# EAGLE design Rev A (Main Board) (EAGLE 9.6.2)
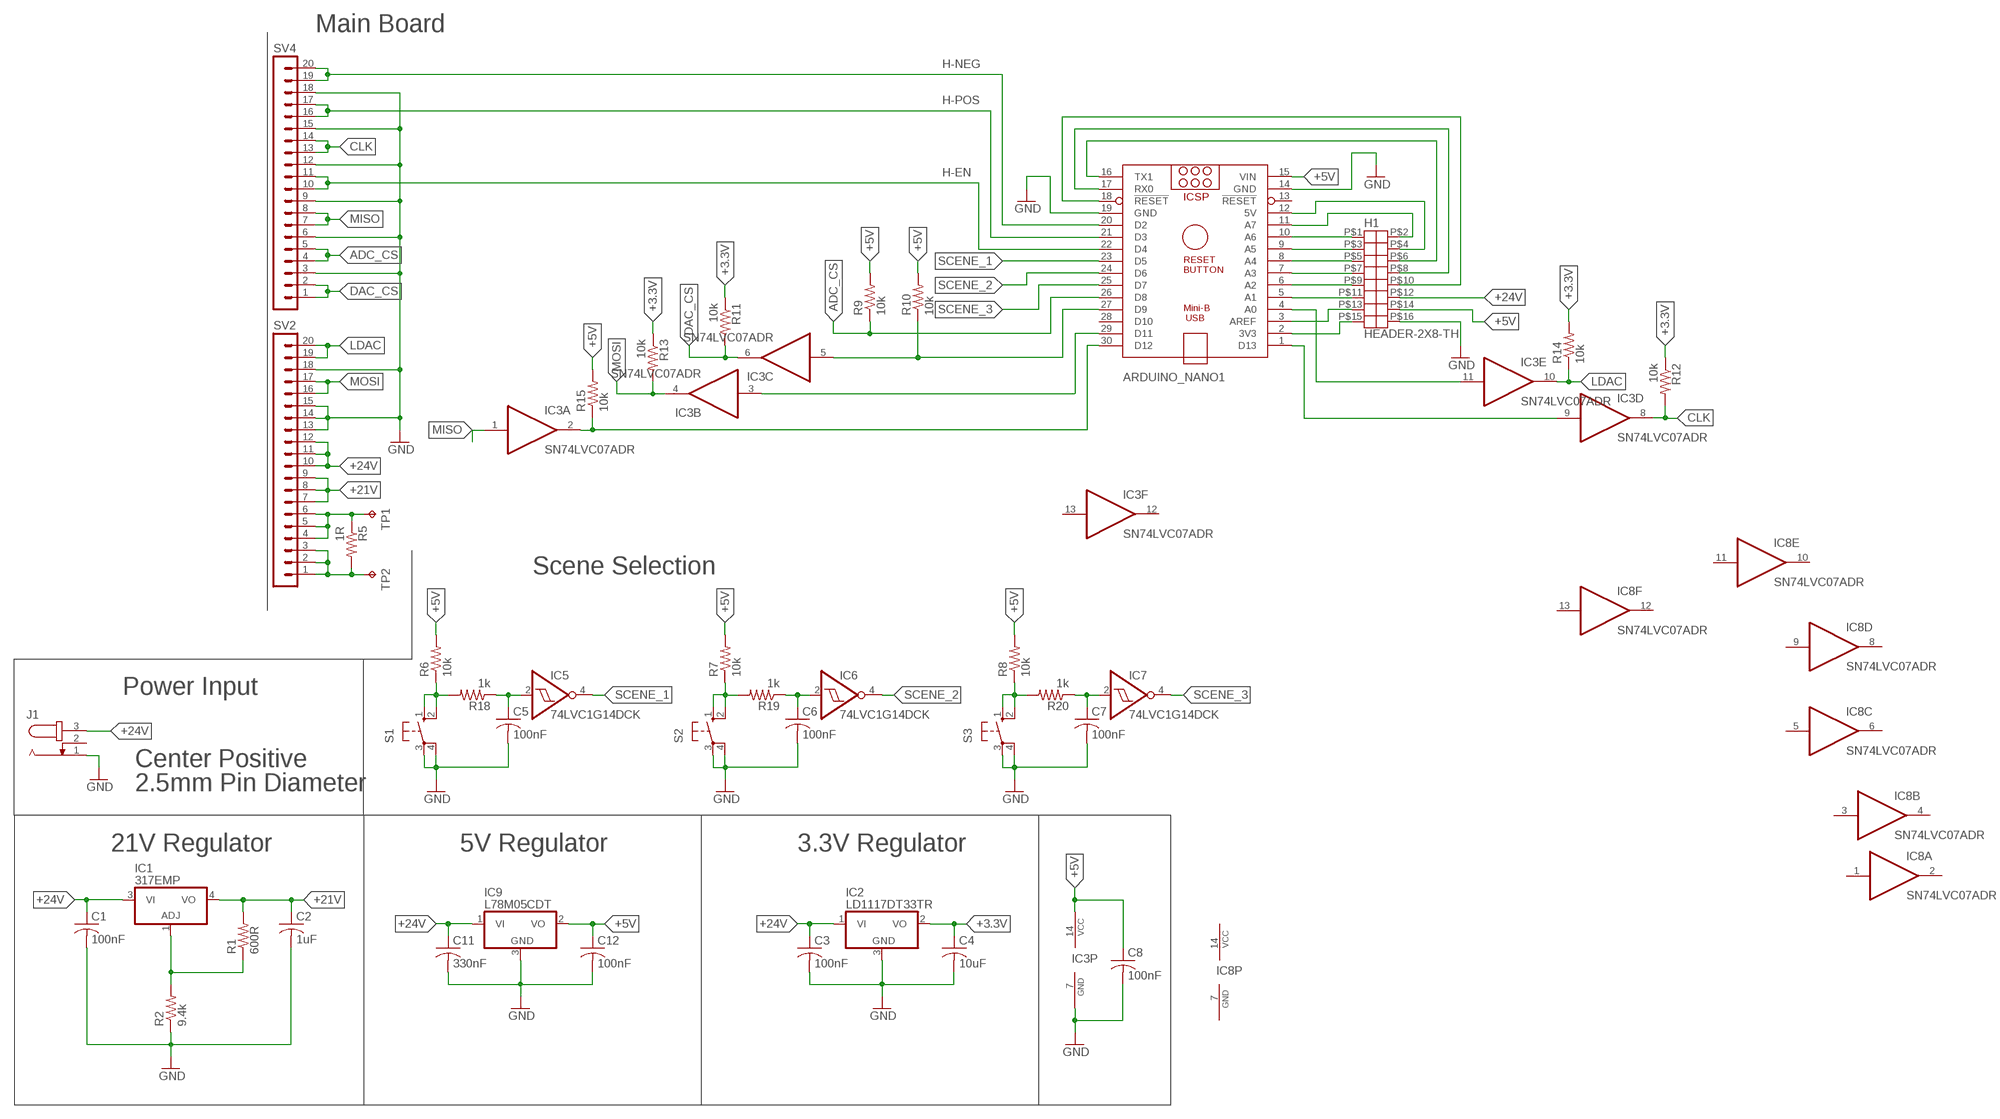
[diagram p0: schematic, sheet 1]

## Parts
ARDUINO_NANO1  ARDUINO_NANO  [ARDUINO_NANO]
C1  100nF  C-USC0603  [C0603]
C2  1uF  C-USC1206  [C1206]
C3  100nF  C-USC0603  [C0603]
C4  10uF  C-USC0603  [C0603]
C5  100nF  C-USC0603  [C0603]
C6  100nF  C-USC0603  [C0603]
C7  100nF  C-USC0603  [C0603]
C8  100nF  C-USC0603  [C0603]
C11  330nF  C-USC0603  [C0603]
C12  100nF  C-USC0603  [C0603]
H1  HEADER-2X8-TH  [HEADER-2X8-TH]
IC1  317EMP  [SOT223]
IC2  LD1117DT33TR  7818DT  [TO252]
IC3  SN74LVC07ADR  74LS07D  [SO14]
IC5  74LVC1G14DCK  [SC70-5]
IC6  74LVC1G14DCK  [SC70-5]
IC7  74LVC1G14DCK  [SC70-5]
IC8  SN74LVC07ADR  74LS07D  [SO14]
IC9  L78M05CDT  7818DT  [TO252]
J1  JACK-PLUG1  [SPC4078]
R1  600R  R-US_R0603  [R0603]
R2  9.4k  R-US_R0603  [R0603]
R5  1R  R-US_R1206  [R1206]
R6  10k  R-US_R0603  [R0603]
R7  10k  R-US_R0603  [R0603]
R8  10k  R-US_R0603  [R0603]
R9  10k  R-US_R0603  [R0603]
R10  10k  R-US_R0603  [R0603]
R11  10k  R-US_R0603  [R0603]
R12  10k  R-US_R0603  [R0603]
R13  10k  R-US_R0603  [R0603]
R14  10k  R-US_R0603  [R0603]
R15  10k  R-US_R0603  [R0603]
R18  1k  R-US_R0603  [R0603]
R19  1k  R-US_R0603  [R0603]
R20  1k  R-US_R0603  [R0603]
S1  10-XX  [B3F-10XX]
S2  10-XX  [B3F-10XX]
S3  10-XX  [B3F-10XX]
SV2  MA20-1W  [MA20-1W]
SV4  MA20-1W  [MA20-1W]
TP1  TPB2,54  [B2,54]
TP2  TPB2,54  [B2,54]

## Nets
+3.3V: C4.1 IC2.2(VO) R11.1 R12.1 R13.1 R14.2
+5V: ARDUINO_NANO1.15(VIN) C8.1 C12.1 H1.P$14 IC3.14(P:VCC) IC9.2(VO) R6.2 R7.2 R8.2 R9.2 R10.2 R15.2
+21V: C2.1 IC1.4(VO) R1.2 SV2.7 SV2.8 SV2.9
+24V: C1.1 C3.1 C11.1 H1.P$12 IC1.3(VI) IC2.1(VI) IC9.1(VI) J1.3 SV2.10 SV2.11 SV2.12
ADC_CS: ARDUINO_NANO1.26(D8) R9.1 SV4.4 SV4.5
CLK: IC3.8(D:O) R12.2 SV4.13 SV4.14
DAC_CS: IC3.6(C:O) R11.2 SV4.1 SV4.2
GND: ARDUINO_NANO1.14(GND) ARDUINO_NANO1.19(GND) C1.2 C2.2 C3.2 C4.2 C5.2 C6.2 C7.2 C8.2 C11.2 C12.2 H1.P$16 IC2.3(GND) IC3.7(P:GND) IC9.3(GND) J1.1 R2.1 S1.3(P) S1.4(P1) S2.3(P) S2.4(P1) S3.3(P) S3.4(P1) SV2.13 SV2.14 SV2.15 SV2.18 SV4.3 SV4.6 SV4.9 SV4.12 SV4.15 SV4.18
LDAC: IC3.10(E:O) R14.1 SV2.19 SV2.20
MISO: IC3.1(A:I) SV4.7 SV4.8
MOSI: IC3.4(B:O) R13.2 SV2.16 SV2.17
N$2: IC1.1(ADJ) R1.1 R2.2
N$3: ARDUINO_NANO1.20(D2) SV4.19 SV4.20
N$4: ARDUINO_NANO1.2(3V3) H1.P$15
N$5: ARDUINO_NANO1.21(D3) SV4.16 SV4.17
N$6: ARDUINO_NANO1.3(AREF) H1.P$13
N$7: ARDUINO_NANO1.5(A1) H1.P$11
N$8: ARDUINO_NANO1.6(A2) H1.P$9
N$9: ARDUINO_NANO1.22(D4) SV4.10 SV4.11
N$10: ARDUINO_NANO1.7(A3) H1.P$7
N$11: ARDUINO_NANO1.8(A4) H1.P$5
N$12: ARDUINO_NANO1.9(A5) H1.P$3
N$13: ARDUINO_NANO1.10(A6) H1.P$1
N$14: ARDUINO_NANO1.11(A7) H1.P$2
N$15: ARDUINO_NANO1.12(5V) H1.P$4
N$16: ARDUINO_NANO1.16(TX1) H1.P$6
N$17: ARDUINO_NANO1.17(RX0) H1.P$8
N$18: ARDUINO_NANO1.18(!RESET) H1.P$10
N$19: ARDUINO_NANO1.27(D9) IC3.5(C:I) R10.1
N$20: ARDUINO_NANO1.1(D13) IC3.9(D:I)
N$21: ARDUINO_NANO1.29(D11) IC3.3(B:I)
N$22: R5.1 SV2.4 SV2.5 SV2.6 TP1.TP
N$23: R5.2 SV2.1 SV2.2 SV2.3 TP2.TP
N$24: ARDUINO_NANO1.4(A0) IC3.11(E:I)
N$25: ARDUINO_NANO1.30(D12) IC3.2(A:O) R15.1
N$27: R6.1 R18.2 S1.1(S) S1.2(S1)
N$28: C5.1 IC5.2(I) R18.1
N$29: R7.1 R19.2 S2.1(S) S2.2(S1)
N$30: C6.1 IC6.2(I) R19.1
N$31: R8.1 R20.2 S3.1(S) S3.2(S1)
N$32: C7.1 IC7.2(I) R20.1
SCENE_1: ARDUINO_NANO1.23(D5) IC5.4(O)
SCENE_2: ARDUINO_NANO1.24(D6) IC6.4(O)
SCENE_3: ARDUINO_NANO1.25(D7) IC7.4(O)
Unconnected: ARDUINO_NANO1.13(!RESET) ARDUINO_NANO1.28(D10) IC3.12(F:O) IC3.13(F:I) IC8.1(A:I) IC8.2(A:O) IC8.3(B:I) IC8.4(B:O) IC8.5(C:I) IC8.6(C:O) IC8.8(D:O) IC8.9(D:I) IC8.10(E:O) IC8.11(E:I) IC8.12(F:O) IC8.13(F:I) J1.2

## Notes on the sheet
- Main Board
- H-NEG
- H-POS
- H-EN
- Scene Selection
- Power Input
- Center Positive
- 2.5mm Pin Diameter
- 21V Regulator | 5V Regulator | 3.3V Regulator

## Power pins joined to a net without a drawn wire
GND: IC5.3(GND) IC6.3(GND) IC7.3(GND) IC8.7(P:GND)
VCC: IC5.5(VCC) IC6.5(VCC) IC7.5(VCC) IC8.14(P:VCC)

## Library data of the parts
ARDUINO_NANO1 = ArduinoNanoV30:ARDUINO_NANO: Arduino Nano V3.0 Overview: The Arduino Nano is a small, complete, and breadboard-friendly board based on the ATmega328 (Arduino Nano 3.x) or ATmega168 (Arduino Nano 2.x). It has more or less the same functionality of the Arduino Duemilanove, but in a different package. It lacks only a DC power jack, and works with a Mini-B USB cable instead of a standard one. The Nano was designed and is being produced by Gravitech. Specifications: Microcontroller Atmel ATmega168 or ATmega328 Operating Voltage (logic level) 5 V Input Voltage (recommended) 7-12 V Input Voltage (limits) 6-20 V Digital I/O Pins 14 (of which 6 provide PWM output) Analog Input Pins 8 DC Current per I/O Pin 40 mA Flash Memory 16 KB (ATmega168) or 32 KB (ATmega328) of which 2 KB used by bootloader SRAM 1 KB (ATmega168) or 2 KB (ATmega328) EEPROM 512 bytes (ATmega168) or 1 KB (ATmega328) Clock Speed 16 MHz Dimensions 0.73" x 1.70" Length 45 mm Width 18 mm Weigth 5 g Power: The Arduino Nano can be powered via the Mini-B USB connection, 6-20V unregulated external power supply (pin 30), or 5V regulated external power supply (pin 27). The power source is automatically selected to the highest voltage source. Memory: The ATmega168 has 16 KB of flash memory for storing code (of which 2 KB is used for the bootloader); the ATmega328 has 32 KB, (also with 2 KB used for the bootloader). The ATmega168 has 1 KB of SRAM and 512 bytes of EEPROM (which can be read and written with the EEPROM library); the ATmega328 has 2 KB of SRAM and 1 KB of EEPROM. Input and Output: Each of the 14 digital pins on the Nano can be used as an input or output, using pinMode(), digitalWrite(), and digitalRead() functions. They operate at 5 volts. Each pin can provide or receive a maximum of 40 mA and has an internal pull-up resistor (disconnected by default) of 20-50 kOhms. In addition, some pins have specialized functions. Visit Arduino - ArduinoBoardNano <https://www.arduino.cc/en/Main/ArduinoBoardNano>
C1-C8 C11 C12 = MMIModular Parts:C-US: CAPACITOR, American symbol; SPICEPREFIX: C
H1 = 4ms-main-parts:HEADER-2X8: SMT HEADER 2x8 Unshrouded: Cixi Langling LL1010-5C (HI TEMP 2*8PIN) Shrouded: Cixi Langling LL1007-3 (2*8PIN)
IC1 = linear:*317: Positive VOLTAGE REGULATOR
IC2 IC9 = linear:78*: Positive VOLTAGE REGULATOR Source: http://cache.national.com/ds/LM/LM78L05.pdf http://www.fairchildsemi.com/ds/LM/LM7805.pdf
IC3 IC8 = 74xx-us:74*07: Hex BUFFER, open collector high-voltage output
IC5-IC7 = 74xx-little-de:74*1G14: Single Schmitt-Trigger Inverter Gate
J1 = con-jack:JACK-PLUG: DC POWER JACK Power Jack, DC, Right Angle, Through Hole, Rated 5A at 16VDC, PC Terminals Distributor: Farnell (www.Farnell.de) Drawing: 84N1161.pdf / 84N1162.pdf Manufacturer: SPC Technology (www.spctechnology.com) Type: SPC4077 / SPC 4078; OC_FARNELL: unknown; OC_NEWARK: unknown
R1 R2 R5-R15 R18-R20 = MMIModular Parts:R-US_: RESISTOR, American symbol; SPICEPREFIX: R
S1-S3 = switch-omron:10-XX: OMRON SWITCH; MPN: B3F-1000; OC_FARNELL: 176432; OC_NEWARK: 36M3542
SV2 SV4 = con-lstb:MA20-1W: PIN HEADER; OC_FARNELL: unknown; OC_NEWARK: unknown
TP1 TP2 = testpad:TP: Test pad

## Board
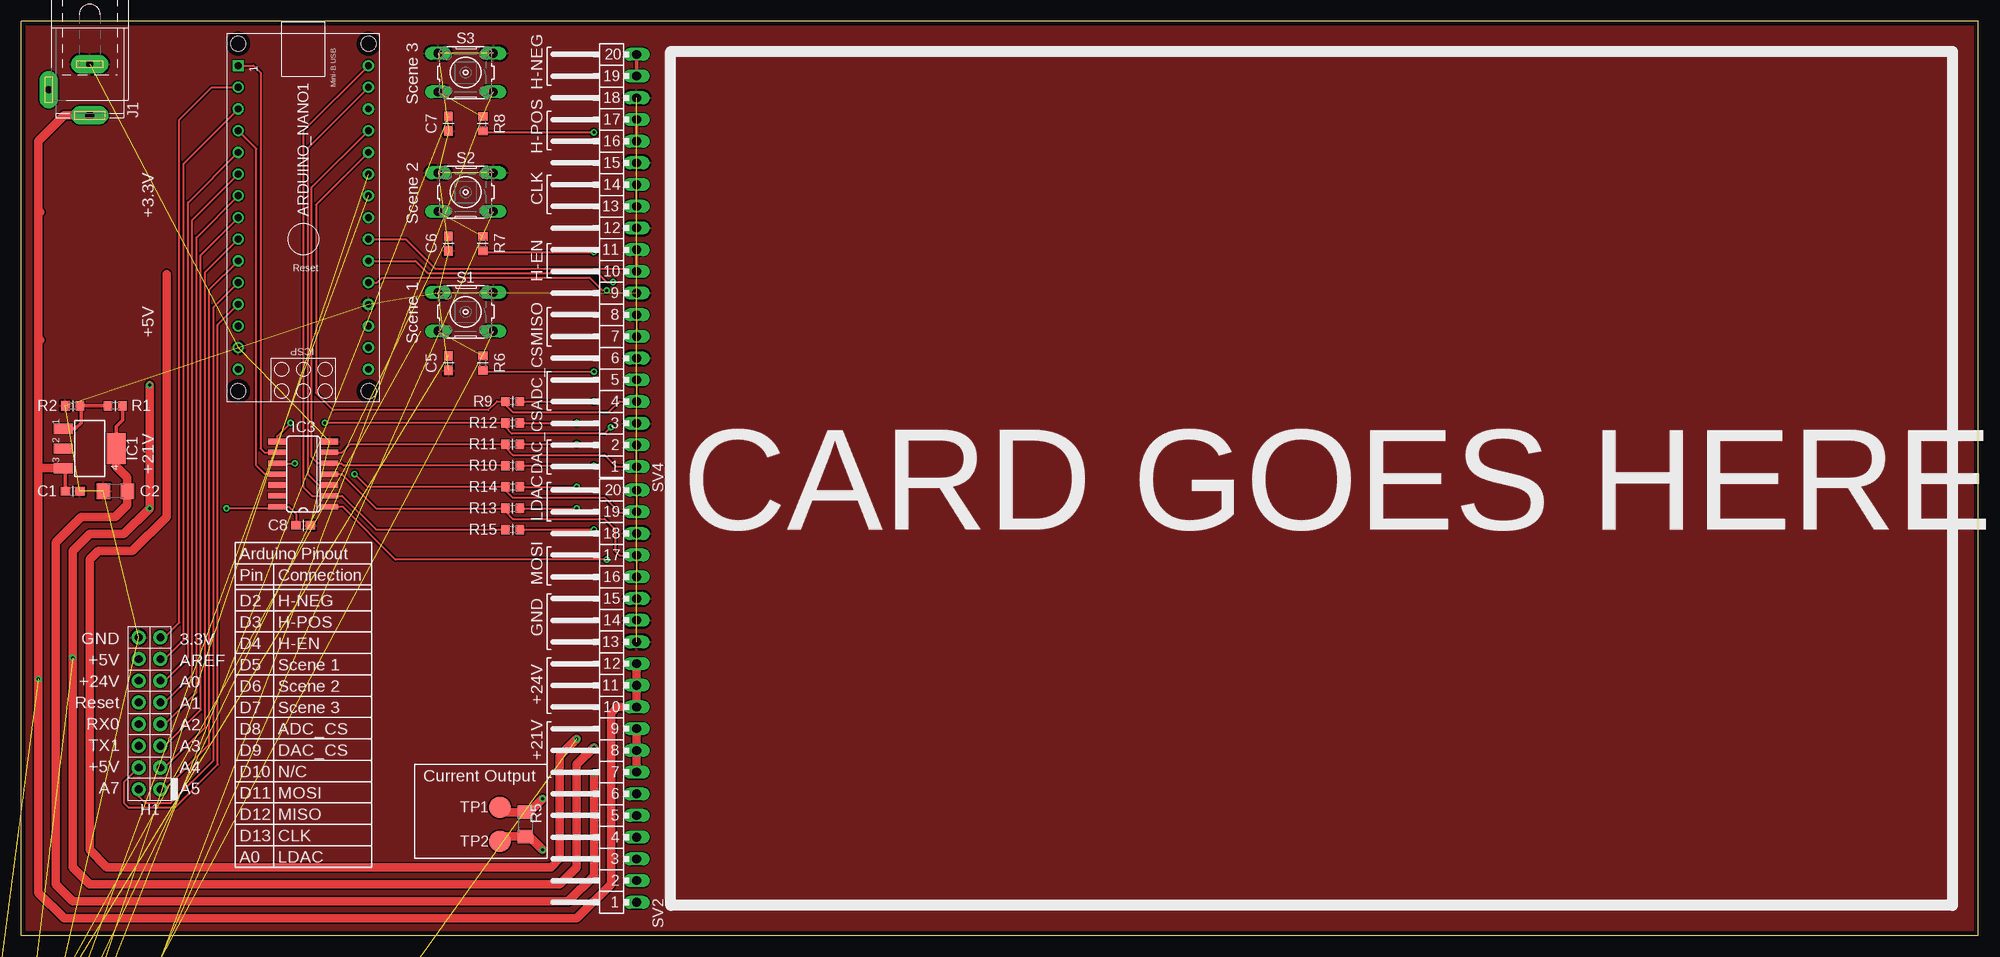
[diagram p1: board, top side]
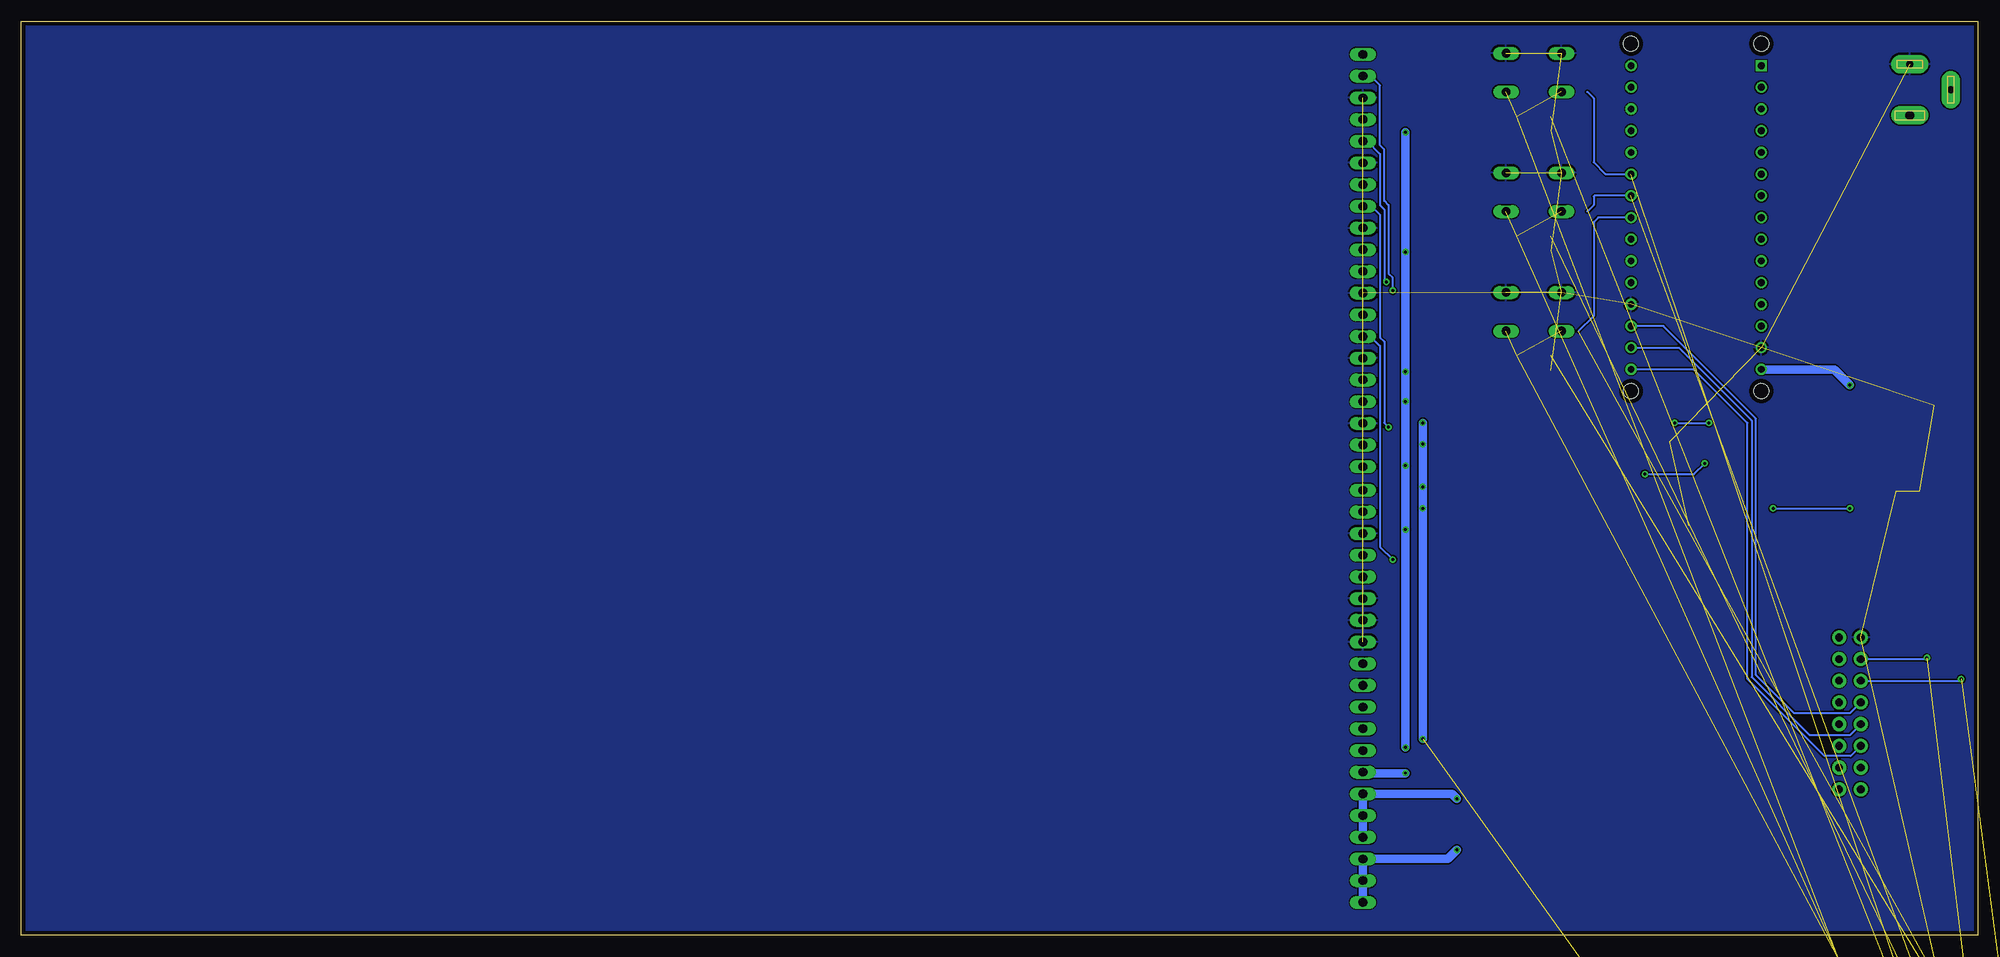
[diagram p2: board, bottom side, seen from below]

Size 229 x 107 mm. Coordinates in mm from the lower left corner, seen from the top.
Outline: 0,0 229,0 229,107 0,107 0,0
Copper layers (1*16): Top 0.035mm / dielectric 1.5mm / Bottom 0.035mm
Design rules "default *": minimum track width 6mil, minimum drill 0.35mm, track to track 6mil, track to pad 6mil, pad to pad 6mil, via to via 6mil, smd to smd 6mil, copper to edge 20mil, drill to drill 6mil, minimum pad ring 10mil, minimum via ring 8mil, stop-mask expansion 4mil, vias tented up to drill 0mil, thermal gap 10mil

### Footprints (pad centres in the part's own frame; a part is rotated, then mirrored left to right if it is on the bottom)
ARDUINO_NANO = drill 0.8 square: 1 -20.32,-7.62 | drill 0.8: 2 -17.78,-7.62; 3 -15.24,-7.62; 4 -12.7,-7.62; 5 -10.16,-7.62; 6 -7.62,-7.62; 7 -5.08,-7.62; 8 -2.54,-7.62; 9 0,-7.62; 10 2.54,-7.62; 11 5.08,-7.62; 12 7.62,-7.62; 13 10.16,-7.62; 14 12.7,-7.62; 15 15.24,-7.62; 16 15.24,7.62; 17 12.7,7.62; 18 10.16,7.62; 19 7.62,7.62; 20 5.08,7.62; 21 2.54,7.62; 22 0,7.62; 23 -2.54,7.62; 24 -5.08,7.62; 25 -7.62,7.62; 26 -10.16,7.62; 27 -12.7,7.62; 28 -15.24,7.62; 29 -17.78,7.62; 30 -20.32,7.62 | hole 1.778: -22.86,-7.62; -22.86,7.62; 17.78,7.62; 17.78,-7.62
C0603 = smd 1.1 x 1: 1 -0.85,0; 2 0.85,0
C1206 = smd 1.6 x 1.8: 1 -1.4,0; 2 1.4,0
HEADER-2X8-TH = drill 0.9 pad 1.651: P$1 -1.27,8.89; P$2 1.27,8.89; P$3 -1.27,6.35; P$4 1.27,6.35; P$5 -1.27,3.81; P$6 1.27,3.81; P$7 -1.27,1.27; P$8 1.27,1.27; P$9 -1.27,-1.27; P$10 1.27,-1.27; P$11 -1.27,-3.81; P$12 1.27,-3.81; P$13 -1.27,-6.35; P$14 1.27,-6.35; P$15 -1.27,-8.89; P$16 1.27,-8.89
SOT223 = smd 1.219 x 2.235: 1 -2.311,-3.099; 2 0,-3.099; 3 2.311,-3.099 | smd 3.6 x 2.2: 4 0,3.099
TO252 = smd 1 x 1.6: 1 -2.28,-4.8; 2 2.28,-4.8 | smd 5.4 x 6.2: 3 0,2.5
SO14 = smd 0.66 x 2.032: 1 -3.81,-3.073; 2 -2.54,-3.073; 3 -1.27,-3.073; 4 0,-3.073; 5 1.27,-3.073; 6 2.54,-3.073; 7 3.81,-3.073; 8 3.81,3.073; 9 2.54,3.073; 10 1.27,3.073; 11 0,3.073; 12 -1.27,3.073; 13 -2.54,3.073; 14 -3.81,3.073
SC70-5 = smd 0.4 x 0.7: 1 -0.65,-0.85; 2 0,-0.85; 3 0.65,-0.85; 4 0.65,0.85; 5 -0.65,0.85
SPC4078 = drill 0.8 pad 2.184 long: 1 -3,0; 2 0,-4.8 | drill 1 pad 2.184 long: 3 3,0
R0603 = smd 1 x 1.1: 1 -0.85,0; 2 0.85,0
R1206 = smd 1.6 x 1.803: 1 -1.422,0; 2 1.422,0
B3F-10XX = drill 1.016 long: 1 -3.251,2.261; 2 3.251,2.261; 3 -3.251,-2.261; 4 3.251,-2.261
MA20-1W = drill 1.016 long: 1 -24.13,0; 2 -21.59,0; 3 -19.05,0; 4 -16.51,0; 5 -13.97,0; 6 -11.43,0; 7 -8.89,0; 8 -6.35,0; 9 -3.81,0; 10 -1.27,0; 11 1.27,0; 12 3.81,0; 13 6.35,0; 14 8.89,0; 15 11.43,0; 16 13.97,0; 17 16.51,0; 18 19.05,0; 19 21.59,0; 20 24.13,0
B2,54 = smd 2.54 x 2.54: TP 0,0

### Placement (x,y rotation side)
ARDUINO_NANO1  33,81.5 270 top
C1  6,52 0 top
C2  11,52 180 top
C3  -10,-77 0 top  (outside the outline)
C4  -3,-77 0 top  (outside the outline)
C5  50,67 270 top
C6  50,81 270 top
C7  50,95 270 top
C8  33,48 0 top
C11  -10,-52 0 top  (outside the outline)
C12  -10,-57 0 top  (outside the outline)
H1  15,26 180 top
IC1  8,57 270 top
IC2  -6,-68 0 top  (outside the outline)
IC3  33,54 90 top
IC5  3,-8 0 top  (outside the outline)
IC6  3,-15 0 top  (outside the outline)
IC7  3,-22 0 top  (outside the outline)
IC8  7,-45 0 top  (outside the outline)
IC9  -6,-43 0 top  (outside the outline)
J1  8,99 270 top
R1  11,62 0 top
R2  6,62 0 top
R5  59,13 270 top
R6  54,67 270 top
R7  54,81 270 top
R8  54,95 270 top
R9  57.5,62.5 0 top
R10  57.5,55 0 top
R11  57.5,57.5 180 top
R12  57.5,60 180 top
R13  57.5,50 180 top
R14  57.5,52.5 0 top
R15  57.5,47.5 0 top
R18  2,-28 0 top  (outside the outline)
R19  2,-33 0 top  (outside the outline)
R20  2,-38 0 top  (outside the outline)
S1  52,73 180 top
S2  52,87 180 top
S3  52,101 180 top
SV2  72,28 90 top
SV4  72,79 90 top
TP1  56,15 90 top
TP2  56,11 90 top

### Tracks (layer width: path | path; a pad name or v marks a point on that pad's centre or on a via)
+3.3V  (via drill 0.35)  (2 unrouted)
  Top 0.254: R12.1 v65,60 | R11.1 v65,57.5 | R14.2 v65,52.5 | R13.1 v65,50
  Top 1.016: 17,77.4 17,49 13,45 9,45 8,44 8,10 10,8 62,8 63,9 63,21 v65,23
  Bottom 1.016: v65,23 v65,50 v65,52.5 v65,57.5 v65,60
+5V  (via drill 0.35)  (2 unrouted)
  Top 0.254: C8.1 32.15,49.35 31.31,50.19 IC3.14 29.74,50 v24,50 | R10.2 v67,55 | R15.2 v67,47.5 | R9.2 v67,62.5 | R6.2 54.15,66 v67,66 | R7.2 54.15,80 v67,80 | R8.2 54.15,94 v67,94
  Top 1.016: v15,64.4 v15,50 12,47 8,47 6,45 v6,32.5 6,8 8,6 63,6 65,8 65,20 v67,22
  Bottom 0.254: v24,50 v15,50 | H1.P$14 6.15,32.35 v6,32.5
  Bottom 1.016: v67,22 v67,47.5 v67,55 v67,62.5 v67,66 v67,80 v67,94 | ARDUINO_NANO1.15 16.86,66.26 v15,64.4
+21V  (via drill 0.35)
  Top 0.406: IC1.4 11.1,59.6 11.85,60.35 R1.2
  Top 1.016: IC1.4 11.1,54.9 12.4,53.6 C2.1 12.4,50.4 11,49 7,49 4,46 4,6 6,4 64,4 67,7 v67,19 | SV2.7 SV2.8 SV2.9
  Bottom 1.016: SV2.7 71.89,19 v67,19
+24V  (via drill 0.35)  (4 unrouted)
  Top 0.406: IC1.3 5.15,54.44 C1.1
  Top 1.016: J1.3 5,96 2,93 2,84.5 | 2,84.5 2,69.5 | 2,69.5 2,55 | 2,55 v2,30 2,5 5,2 65,2 69,6 69,26 69.73,26.73 SV2.10 SV2.11 SV2.12 | IC1.3 2.31,54.69 2,55 | 2.19,69.69 2,69.5 | 2.19,84.69 2,84.5
  Bottom 0.254: H1.P$12 2.19,29.81 v2,30
ADC_CS
  Top 0.254: SV4.5 SV4.4 70,62.5 68.75,61.25 57.5,61.25 56.65,62.1 R9.1 55.65,62.5 54.65,61.5 36.5,61.5 34.5,63.5 34.5,85.54 ARDUINO_NANO1.26
CLK  (via drill 0.35)
  Top 0.254: v35.5,60 R12.2 56.65,59.5 57.4,58.75 68.25,58.75 v69,59.5 | IC3.8 29.93,58.43 v31.5,60 | SV4.13 SV4.14
  Bottom 0.254: v35.5,60 v31.5,60 | v69,59.5 69.5,60 69.5,69.5 70,70 70,84.35 71,85.35 SV4.13
DAC_CS
  Top 0.254: IC3.6 37.54,56.54 38.5,57.5 R11.2 56.65,57.1 57.5,56.25 68.25,56.25 69.63,54.87 SV4.1 SV4.2
GND  (37 unrouted)
  pour Top: 0,109.5 0,-3 231.5,-3 231.5,109.5
  pour Bottom: 0,111 0,-4.5 233,-4.5 233,111
LDAC  (via drill 0.35)
  Top 0.254: v39,54 40.5,52.5 R14.1 56.65,52.1 57.5,51.25 68.25,51.25 70,49.5 71.91,49.5 SV2.19 SV2.20 | IC3.10 31.98,55.27 v32,55.25
  Bottom 0.254: v39,54 33.25,54 v32,55.25
MISO  (via drill 0.35)
  Top 0.254: IC3.1 37.57,50.19 43.76,44 v68.5,44 | SV4.8 SV4.7
  Bottom 0.254: SV4.7 71.11,70.11 70,69 70,45.5 v68.5,44
MOSI
  Top 0.254: IC3.4 37.5,54 41.5,50 R13.2 56.65,49.6 57.5,48.75 68.25,48.75 69.5,47.5 69.5,45 70,44.5 SV2.17 SV2.16
N$2
  Top 0.406: IC1.1 6.31,59.31 7,60 7,61.85 R2.2 R1.1
N$3  (via drill 0.35)
  Top 0.254: ARDUINO_NANO1.20 41.62,76.42 42.2,77 66.5,77 68,75.5 v68.5,75.5
  Top 0.406: SV4.19 SV4.20
  Bottom 0.254: SV4.19 71.09,100.59 70,99.5 70,92.5 69.5,92 69.5,86 69,85.5 69,77.5 68.5,77 v68.5,75.5
N$4
  Top 0.254: H1.P$15 16.77,34.89 18.5,36.62 18.5,95.5 22.28,99.28 ARDUINO_NANO1.2
N$5  (via drill 0.35)
  Top 0.254: ARDUINO_NANO1.21 46.12,78.96 47.58,77.5 67.5,77.5 68.5,76.5 v69.25,76.5
  Top 0.406: SV4.16 SV4.17
  Bottom 0.254: v69.25,76.5 69.5,76.75 69.5,84.97 70,85.47 70,91.47 71.5,92.97 SV4.16
N$6
  Top 0.254: H1.P$13 16.77,32.35 19,34.58 19,90.36 ARDUINO_NANO1.3
N$7
  Top 0.254: H1.P$11 16.77,29.81 19.5,32.54 19.5,85.78 ARDUINO_NANO1.5
N$8
  Top 0.254: H1.P$9 16.77,27.27 20,30.5 20,83.74 ARDUINO_NANO1.6
N$9
  Top 0.254: ARDUINO_NANO1.22 45,81.5 48.5,78 71.73,78 SV4.10
  Top 0.406: SV4.10 SV4.11
N$10
  Top 0.254: H1.P$7 16.77,24.73 20.5,28.46 20.5,81.7 ARDUINO_NANO1.7
N$11
  Top 0.254: H1.P$5 16.77,22.19 21,26.42 21,79.66 ARDUINO_NANO1.8
N$12
  Top 0.254: H1.P$3 16.77,19.65 21.5,24.38 21.5,77.62 ARDUINO_NANO1.9
N$13
  Top 0.254: H1.P$1 16.77,17.11 22,22.34 22,75.58 ARDUINO_NANO1.10
N$14
  Top 0.254: H1.P$2 13.73,16.27 14.5,15.5 17.5,15.5 22.5,20.5 22.5,73.54 ARDUINO_NANO1.11
N$15
  Top 0.254: H1.P$4 12,17.92 12,15.5 12.5,15 18,15 23,20 23,71.5 ARDUINO_NANO1.12
N$16
  Bottom 0.254: H1.P$6 14.92,21 18,21 27,30 27,60 33.26,66.26 ARDUINO_NANO1.16
N$17
  Bottom 0.254: ARDUINO_NANO1.17 35.05,68.8 26.5,60.25 26.5,30.25 19.75,23.5 14.96,23.5 H1.P$8
N$18
  Bottom 0.254: H1.P$10 15,26 21.5,26 26,30.5 26,60.5 36.84,71.34 ARDUINO_NANO1.18
N$19
  Top 0.254: ARDUINO_NANO1.27 34,87.58 34,56 34.73,55.27 IC3.5 37.48,55.27 37.75,55 R10.1
N$20
  Top 0.254: ARDUINO_NANO1.1 27.18,101.82 28,101 28,57 28.5,56.5 29.89,56.5 IC3.9
N$21
  Top 0.254: ARDUINO_NANO1.29 33.5,92.16 33.5,54 34.77,52.73 IC3.3
N$22  (via drill 0.35)
  Top 1.016: v61,16 59.42,14.42 R5.1 56.58,14.42 TP1.TP
  Bottom 1.016: v61,16 61.57,16.57 SV2.6 SV2.5 SV2.4
N$23  (via drill 0.35)
  Top 1.016: v61,10 59.42,11.58 R5.2 56.58,11.58 TP2.TP
  Bottom 1.016: v61,10 62.05,8.95 SV2.3 SV2.2 SV2.1
N$24
  Top 0.254: IC3.11 28.5,54 27.5,55 27.5,92.08 ARDUINO_NANO1.4
N$25
  Top 0.254: ARDUINO_NANO1.30 33,94.2 33,52.5 34.04,51.46 IC3.2 37.54,51.46 41.5,47.5 R15.1
N$27  (3 unrouted)
N$28  (2 unrouted)
N$29  (3 unrouted)
N$30  (2 unrouted)
N$31  (3 unrouted)
N$32  (2 unrouted)
SCENE_1  (1 unrouted)
  Bottom 0.254: ARDUINO_NANO1.23 44.46,84.04 45,83.5 45,72.5 46.76,70.74
SCENE_2  (1 unrouted)
  Bottom 0.254: ARDUINO_NANO1.24 44.92,86.58 45,86.5 45,85.5 45.76,84.74
SCENE_3  (1 unrouted)
  Bottom 0.254: 45.74,98.74 45,98 45,90.5 43.62,89.12 ARDUINO_NANO1.25
VCC  (3 unrouted)

### Text on the board
tPlace: Scene 3 | H-NEG | H-POS | Scene 2 | CLK | +3.3V | Scene 1 | H-EN | +5V | MISO | ADC_CS | +21V | DAC_CS | CARD GOES HERE | LDAC | Arduino Pinout | Pin | Connection | MOSI | D2 | H-NEG | GND | D3 | H-POS | GND | 3.3V | D4 | H-EN | +5V | AREF | D5 | Scene 1 | +24V | A0 | Reset | D6 | Scene 2 | +24V | RX0 | A1 | D7 | Scene 3 | A2 | D8 | ADC_CS | TX1 | A3 | D9 | DAC_CS | +5V | +21V | A4 | A7 | D10 | N/C | Current Output | A5 | D11 | MOSI | D12 | MISO | D13 | CLK | A0 | LDAC